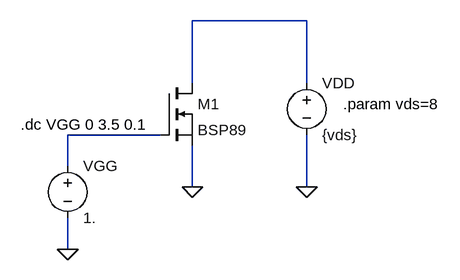
[diagram p0: schematic bsp89_input_charac.asc]
bsp89_input_charac.asc, the LTspice schematic file:
Version 4
SHEET 1 880 680
WIRE 368 32 192 32
WIRE 192 128 192 32
WIRE 368 128 368 32
WIRE 144 208 0 208
WIRE 0 256 0 208
WIRE 192 288 192 224
WIRE 368 288 368 208
WIRE 0 384 0 336
FLAG 368 288 0
FLAG 192 288 0
FLAG 0 384 0
SYMBOL nmos 144 128 R0
SYMATTR InstName M1
SYMATTR Value BSP89
SYMBOL voltage 0 240 R0
WINDOW 123 0 0 Left 0
WINDOW 39 0 0 Left 0
SYMATTR InstName VGG
SYMATTR Value 1.
SYMBOL voltage 368 112 R0
WINDOW 123 0 0 Left 0
WINDOW 39 0 0 Left 0
SYMATTR InstName VDD
SYMATTR Value {vds}
TEXT -72 192 Left 2 !.dc VGG 0 3.5 0.1
TEXT 424 160 Left 2 !.param vds=8

The netlist it stands for:
* bsp89_input_charac.asc
M1 N001 N002 0 0 BSP89
VGG N002 0 1.
VDD N001 0 {vds}
.model NMOS NMOS
.model PMOS PMOS
.lib standard.mos
.dc VGG 0 3.5 0.1
.param vds=8
.backanno
.end